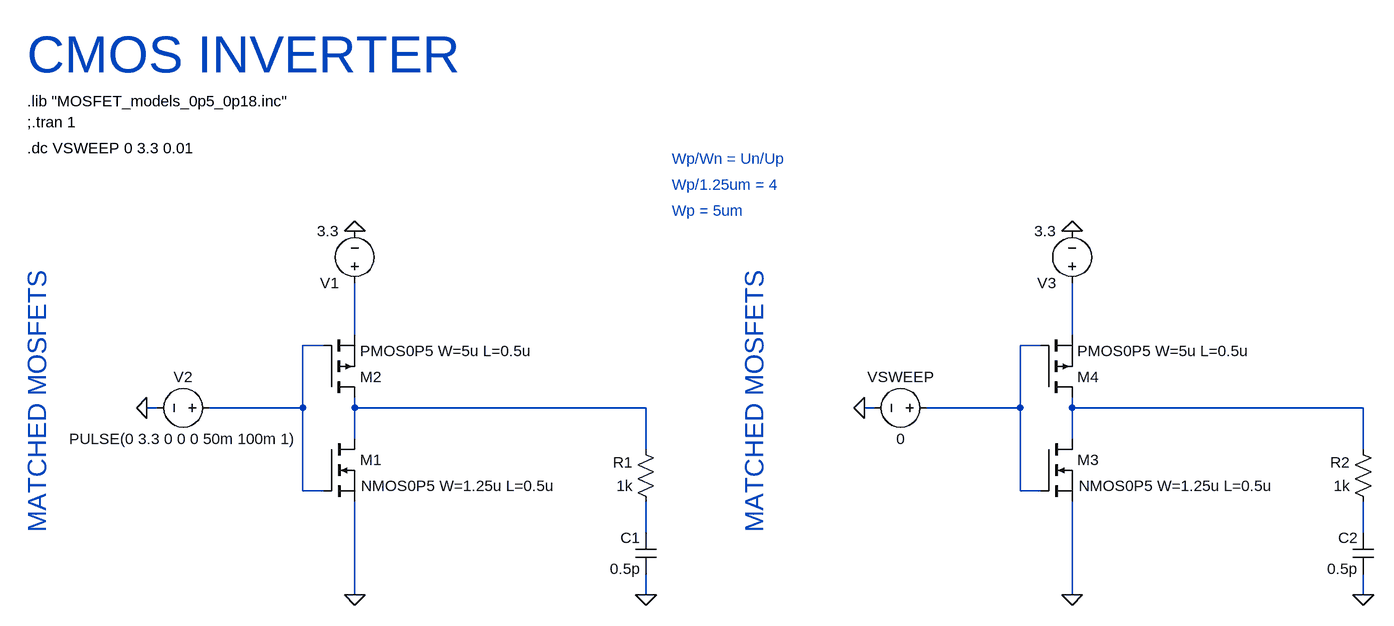
[diagram p0: schematic CMOS_0.5_INV_Mactched.asc]
CMOS_0.5_INV_Mactched.asc, the LTspice schematic file:
Version 4
SHEET 1 1700 1640
WIRE -880 -224 -880 -304
WIRE 224 -224 224 -304
WIRE -928 -208 -960 -208
WIRE 176 -208 144 -208
WIRE -1184 -112 -1200 -112
WIRE -960 -112 -960 -208
WIRE -960 -112 -1104 -112
WIRE -880 -112 -880 -128
WIRE -432 -112 -880 -112
WIRE -80 -112 -96 -112
WIRE 144 -112 144 -208
WIRE 144 -112 0 -112
WIRE 224 -112 224 -128
WIRE 672 -112 224 -112
WIRE -880 -64 -880 -112
WIRE 224 -64 224 -112
WIRE -432 -48 -432 -112
WIRE 672 -48 672 -112
WIRE -960 16 -960 -112
WIRE -928 16 -960 16
WIRE 144 16 144 -112
WIRE 176 16 144 16
WIRE -432 80 -432 32
WIRE 672 80 672 32
WIRE -880 176 -880 32
WIRE -432 176 -432 144
WIRE 224 176 224 32
WIRE 672 176 672 144
FLAG -880 176 0
FLAG -880 -384 0
FLAG -1200 -112 0
FLAG -432 176 0
FLAG 224 176 0
FLAG 224 -384 0
FLAG -96 -112 0
FLAG 672 176 0
SYMBOL nmos -928 -64 R0
WINDOW 3 58 72 Left 2
SYMATTR Value NMOS0P5 W=1.25u L=0.5u
SYMATTR InstName M1
SYMBOL pmos -928 -128 M180
SYMATTR InstName M2
SYMATTR Value PMOS0P5 W=5u L=0.5u
SYMBOL voltage -880 -288 R180
WINDOW 123 0 0 Left 0
WINDOW 39 0 0 Left 0
SYMATTR InstName V1
SYMATTR Value 3.3
SYMBOL voltage -1088 -112 R90
WINDOW 0 -32 56 VBottom 2
WINDOW 3 32 56 VTop 2
WINDOW 123 0 0 Left 0
WINDOW 39 0 0 Left 0
SYMATTR InstName V2
SYMATTR Value PULSE(0 3.3 0 0 0 50m 100m 1)
SYMBOL res -416 48 R180
WINDOW 0 36 76 Left 2
WINDOW 3 36 40 Left 2
SYMATTR InstName R1
SYMATTR Value 1k
SYMBOL cap -416 144 R180
WINDOW 0 24 56 Left 2
WINDOW 3 24 8 Left 2
SYMATTR InstName C1
SYMATTR Value 0.5p
SYMBOL nmos 176 -64 R0
WINDOW 3 58 72 Left 2
SYMATTR Value NMOS0P5 W=1.25u L=0.5u
SYMATTR InstName M3
SYMBOL pmos 176 -128 M180
SYMATTR InstName M4
SYMATTR Value PMOS0P5 W=5u L=0.5u
SYMBOL voltage 224 -288 R180
WINDOW 123 0 0 Left 0
WINDOW 39 0 0 Left 0
SYMATTR InstName V3
SYMATTR Value 3.3
SYMBOL voltage 16 -112 R90
WINDOW 0 -32 56 VBottom 2
WINDOW 3 32 56 VTop 2
WINDOW 123 0 0 Left 0
WINDOW 39 0 0 Left 0
SYMATTR InstName VSWEEP
SYMATTR Value 0
SYMBOL res 688 48 R180
WINDOW 0 36 76 Left 2
WINDOW 3 36 40 Left 2
SYMATTR InstName R2
SYMATTR Value 1k
SYMBOL cap 688 144 R180
WINDOW 0 24 56 Left 2
WINDOW 3 24 8 Left 2
SYMATTR InstName C2
SYMATTR Value 0.5p
TEXT -1384 -584 Left 2 !.lib "MOSFET_models_0p5_0p18.inc"
TEXT -1384 -552 Left 2 !;.tran 1
TEXT -1384 -512 Left 2 !.dc VSWEEP 0 3.3 0.01
TEXT -1368 80 VLeft 4 ;MATCHED MOSFETS
TEXT -1384 -656 Left 6 ;CMOS INVERTER
TEXT -392 -496 Left 2 ;Wp/Wn = Un/Up
TEXT -392 -456 Left 2 ;Wp/1.25um = 4
TEXT -392 -416 Left 2 ;Wp = 5um
TEXT -264 80 VLeft 4 ;MATCHED MOSFETS

The netlist it stands for:
* CMOS_0.5_INV_Mactched.asc
M1 N005 N003 0 0 NMOS0P5 W=1.25u L=0.5u
M2 N005 N003 N001 N001 PMOS0P5 W=5u L=0.5u
V1 N001 0 3.3
V2 N003 0 PULSE(0 3.3 0 0 0 50m 100m 1)
R1 N007 N005 1k
C1 0 N007 0.5p
M3 N006 N004 0 0 NMOS0P5 W=1.25u L=0.5u
M4 N006 N004 N002 N002 PMOS0P5 W=5u L=0.5u
V3 N002 0 3.3
VSWEEP N004 0 0
R2 N008 N006 1k
C2 0 N008 0.5p
.model NMOS NMOS
.model PMOS PMOS
.lib standard.mos
.lib "MOSFET_models_0p5_0p18.inc"
;.tran 1
.dc VSWEEP 0 3.3 0.01
* MATCHED MOSFETS
* CMOS INVERTER
* Wp/Wn = Un/Up
* Wp/1.25um = 4
* Wp = 5um
* MATCHED MOSFETS
.backanno
.end